# Altium schematic sheet Sheet1._(1).SchDoc
size A
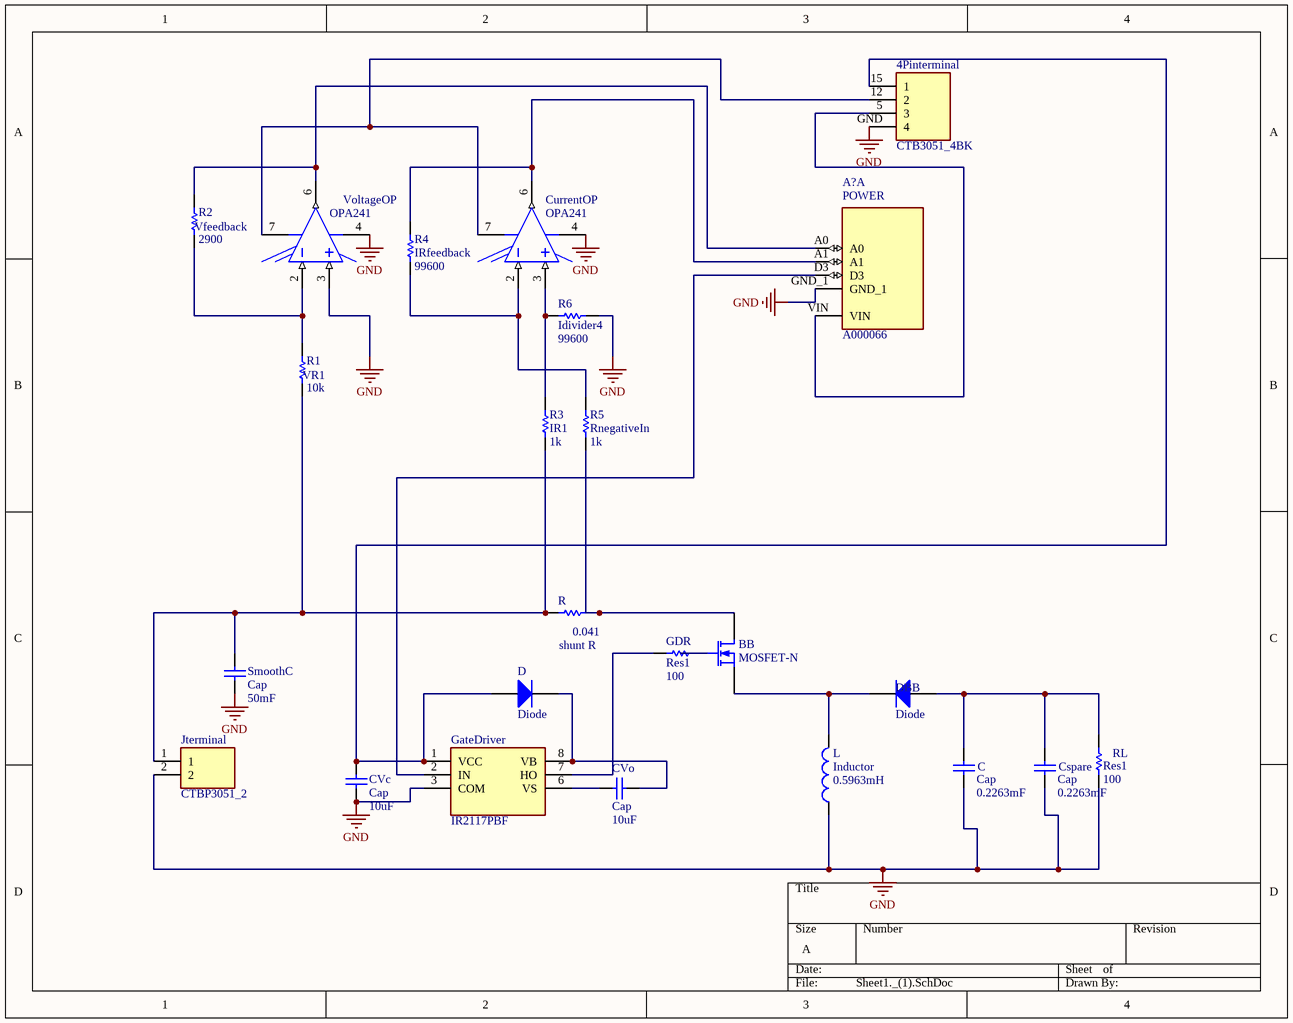
[diagram p0: Sheet1._(1).SchDoc]

## Parts
4Pinterminal  CTB3051_4BK  [CTB30514BK]
A?  A000066  [ARDUINO_A000066]  (part A of 4)
BB  MOSFET-N  [E3]
C  Cap  value 0.2263mF  [RAD-0.3]
Cspare  Cap  value 0.2263mF  [RAD-0.3]
CurrentOP  OPA241  [P0008A]
CVc  Cap  value 10uF  [RAD-0.3]
CVo  Cap  value 10uF  [RAD-0.3]
D  Diode  [SMC]
DBB  Diode  [SMC]
GateDriver  IR2117PBF  [DIP762W56P254L988H533Q8N]
GDR  Res1  value 100  [AXIAL-0.3]
Jterminal  CTBP3051_2  [HDRV2W90P0X350_1X2_700X700X850P]
L  Inductor  value 0.5963mH  [0402-A]
R  shunt R  value 0.041  [AXIAL-0.3]
R1  VR1  value 10k  [AXIAL-0.3]
R2  Vfeedback  value 2900  [AXIAL-0.3]
R3  IR1  value 1k  [AXIAL-0.3]
R4  IRfeedback  value 99600  [AXIAL-0.3]
R5  RnegativeIn  value 1k  [AXIAL-0.3]
R6  Idivider4  value 99600  [AXIAL-0.3]
RL  Res1  value 100  [AXIAL-0.3]
SmoothC  Cap  value 50mF  [RAD-0.3]
VoltageOP  OPA241  [P0008A]

## Nets
GND: 4Pinterminal.GND(4) A?.GND_1 C.1 Cspare.1 CurrentOP.4(V-) CVc.2 GateDriver.3(COM) Jterminal.2 L.1 R6.2 RL.1 SmoothC.1 VoltageOP.3(IN+) VoltageOP.4(V-)
Net4Pinterminal_5: 4Pinterminal.5(3) A?.VIN
Net4Pinterminal_12: 4Pinterminal.12(2) CurrentOP.7(V+) VoltageOP.7(V+)
Net4Pinterminal_15: 4Pinterminal.15(1) CVc.1 D.1(A) GateDriver.1(VCC)
NetA?_A0: A?.A0 R2.2 VoltageOP.6(OUT)
NetA?_A1: A?.A1 CurrentOP.6(OUT) R4.2
NetA?_D3: A?.D3 GateDriver.2(IN)
NetBB_1: BB.1(D) R.1 R5.1
NetBB_2: BB.2(G) GDR.1
NetBB_3: BB.3(S) DBB.2(K) L.2
NetC_2: C.2 Cspare.2 DBB.1(A) RL.2
NetCurrentOP_2: CurrentOP.2(IN-) R4.1 R5.2
NetCurrentOP_3: CurrentOP.3(IN+) R3.2 R6.1
NetCVo_1: CVo.1 D.2(K) GateDriver.8(VB)
NetCVo_2: CVo.2 GateDriver.6(VS)
NetGateDriver_7: GateDriver.7(HO) GDR.2
NetJterminal_1: Jterminal.1 R.2 R1.1 R3.1 SmoothC.2
NetR1_2: R1.2 R2.1 VoltageOP.2(IN-)

## Notes on the sheet
- (in symbol A000066, part A) POWER

## Library data of the parts
4Pinterminal = CTB3051_4BK: Connector; Manufacturer_Name: RS Components; Manufacturer_Part_Number: CTB3051/4BK; Height: 8.5mm; RS Part Number: 8971339; RS Price/Stock: https://uk.rs-online.com/web/p/products/8971339
A? = A000066: Plated Through Hole Protoboard Arduino Mega Platform Evaluation Expansion Board; MP: ARDUINO UNO REV3; Value: *; MF: Arduino; Package: None; Price: None; SnapEDA_Link: https://www.snapeda.com/parts/ARDUINO%20UNO%20REV3/Arduino/view-part/1128320/?ref=snap; Availability: In Stock; Check_prices: https://www.snapeda.com/parts/ARDUINO%20UNO%20REV3/Arduino/view-part/1128320/?ref=eda
BB = MOSFET-N: N-Channel MOSFET; Published: 8-Jun-2000; LatestRevisionDate: 17-Jul-2002; LatestRevisionNote: Re-released for DXP Platform.; PackageVersion: 1995/1996; PackageReference: E3; Publisher: Altium Limited; PackageDescription: TO, Flat Index; 3 In-Line, Axial Leads; Body Dia. 4.6mm; Lead Dia. 0.5 mm (max)
C Cspare CVc CVo SmoothC = Cap: Capacitor; Published: 8-Jun-2000; LatestRevisionDate: 17-Jul-2002; LatestRevisionNote: Re-released for DXP Platform.; PackageReference: RAD-0.3; Publisher: Altium Limited; PackageDescription: Radial Cap, Thru-Hole; 2 Leads; 0.3 in Pin Spacing
CurrentOP VoltageOP = CMP-0272-01606-3: Single-Supply, MicroPower Operational Amplifier, 2.7 to 36 V, -55 to 125 degC, 8-pin DIP (P8), Green (RoHS & no Sb/Br); Manufacturer: Texas Instruments; PartNumber: OPA241PA; IIB(Max)(pA): 20000; Sub Family: High Supply Voltage Amplifier (>=30V), Low Offset Voltage Amplifier (<=500uV), Low Power Amp (<=500uA), Low Supply Voltage Amplifier (<=2.7V), Precision Amplifier; GBW(Typ)(MHz): 0.035; Rating: Catalog; Packing: TUBE; Vio (25C)(Max)(mV): 0.25; Number of Channels: 1; Iq per channel(Max)(mA): 0.03; Slew Rate(Typ)(V/us): 0.01; Offset Drift(Typ)(uV/C): 0.4; Total Supply Voltage(Max)(+5V is 5, +/-5V is 10): 36; Total Supply Voltage(Min)(+5V is 5, +/-5V is 10): 2.7; CMRR(Min)(dB): 80; ComponentLink3Description: Package Specification; ComponentLink2URL: http://www.ti.com/lit/ds/symlink/opa241.pdf; PackageDescription: 8-Pin Plastic In-Line, Body 9.59 x 6.35 mm, Pitch 2.54 mm; Eco-Plan: Green (RoHS & no Sb/Br); PackageReference: P0008A; DatasheetVersion: SBOS075; PackageVersion: 4040082/E, 04/2010; ComponentLink1URL: http://www.ti.com/; ComponentLink3URL: http://www.ti.com/litv/pdf/mpdi001b; Code_JEDEC: MS-001; ComponentLink2Description: Datasheet; Mounting Technology: Through Hole; ComponentLink1Description: Manufacturer URL
D DBB = Diode: Default Diode; Published: 8-Jun-2000; LatestRevisionDate: 17-Jul-2002; LatestRevisionNote: Re-released for DXP Platform.; PackageVersion: Sep-1996; PackageReference: SMC; Publisher: Altium Limited; PackageDescription: DO-214-AB/SMC; 2 C-Bend Leads; Body 7.9 x 5.9 mm, inc. leads (LxW); Code_JEDEC: DO-214-AB
GateDriver = IR2117PBF: Integrated Circuit; Manufacturer_Name: Infineon; Datasheet Link: https://www.infineon.com/dgdl/ir2117.pdf?fileId=5546d462533600a4015355c84331168d; Height: 5.33mm; Manufacturer_Part_Number: IR2117PBF; Mouser Part Number: 942-IR2117PBF; Mouser Price/Stock: https://www.mouser.co.uk/ProductDetail/Infineon-IR/IR2117PBF?qs=dQmlx5f5cRIDilT7sCxYHA%3D%3D; Arrow Part Number: IR2117PBF; Arrow Price/Stock: https://www.arrow.com/en/products/ir2117pbf/infineon-technologies-ag?region=nac
GDR R R1-R6 RL = Res1: Resistor; Published: 8-Jun-2000; LatestRevisionDate: 17-Jul-2002; LatestRevisionNote: Re-released for DXP Platform.; PackageReference: AXIAL-0.3; Publisher: Altium Limited; PackageDescription: Axial Device, Thru-Hole; 2 Leads; 0.3 in Pin Spacing
Jterminal = CTBP3051_2: Connector; Manufacturer_Name: CAMDENBOSS; Manufacturer_Part_Number: CTBP3051/2; Datasheet Link: https://componentsearchengine.com/Datasheets/2/CTBP3051_2.pdf; Height: 8.5mm
L = Inductor: Code_IEC: 1005; Published: 8-Jun-2000; LatestRevisionDate: 29-May-2009; LatestRevisionNote: IPC-7351 Footprint Added.; PackageReference: 0402-A; Publisher: Altium Limited; PackageDescription: Chip Inductor; Code_JEITA: 0402